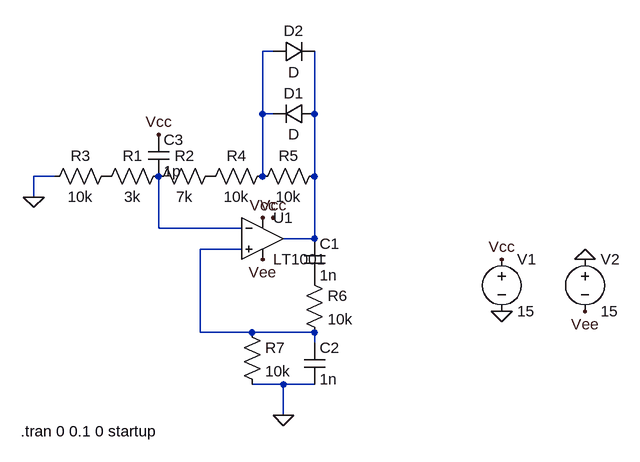
[diagram p0: schematic Draft2.asc]
Draft2.asc, the LTspice schematic file:
Version 4
SHEET 1 880 680
WIRE 192 -112 176 -112
WIRE 176 -16 176 -112
WIRE 192 -16 176 -16
WIRE 256 -16 256 -112
WIRE -144 80 -176 80
WIRE 176 80 176 -16
WIRE 256 80 256 -16
WIRE -176 112 -176 80
WIRE 16 160 16 80
WIRE 144 160 16 160
WIRE 256 176 256 80
WIRE 256 176 208 176
WIRE 144 192 80 192
WIRE 80 320 80 192
WIRE 160 320 80 320
WIRE 256 320 160 320
WIRE 256 336 256 320
WIRE 208 400 160 400
WIRE 256 400 208 400
WIRE 208 448 208 400
FLAG 208 448 0
FLAG -176 112 0
FLAG 544 208 Vcc
FLAG 192 144 Vcc
FLAG 176 144 Vcc
FLAG 176 208 Vee
FLAG 672 288 Vee
FLAG 544 288 0
FLAG 672 208 0
FLAG 16 16 Vcc
SYMBOL Opamps\\LT1001 176 112 R0
SYMATTR InstName U1
SYMBOL res 32 64 R90
WINDOW 0 0 56 VBottom 2
WINDOW 3 32 56 VTop 2
SYMATTR InstName R1
SYMATTR Value 3k
SYMBOL res 112 64 R90
WINDOW 0 0 56 VBottom 2
WINDOW 3 32 56 VTop 2
SYMATTR InstName R2
SYMATTR Value 7k
SYMBOL res -48 64 R90
WINDOW 0 0 56 VBottom 2
WINDOW 3 32 56 VTop 2
SYMATTR InstName R3
SYMATTR Value 10k
SYMBOL res 192 64 R90
WINDOW 0 0 56 VBottom 2
WINDOW 3 32 56 VTop 2
SYMATTR InstName R4
SYMATTR Value 10k
SYMBOL res 272 64 R90
WINDOW 0 0 56 VBottom 2
WINDOW 3 32 56 VTop 2
SYMATTR InstName R5
SYMATTR Value 10k
SYMBOL diode 256 -32 R90
WINDOW 0 0 32 VBottom 2
WINDOW 3 32 32 VTop 2
SYMATTR InstName D1
SYMBOL diode 192 -96 R270
WINDOW 0 32 32 VTop 2
WINDOW 3 0 32 VBottom 2
SYMATTR InstName D2
SYMBOL cap 240 176 R0
SYMATTR InstName C1
SYMATTR Value 1n
SYMBOL cap 240 336 R0
SYMATTR InstName C2
SYMATTR Value 1n
SYMBOL res 240 224 R0
SYMATTR InstName R6
SYMATTR Value 10k
SYMBOL res 144 304 R0
SYMATTR InstName R7
SYMATTR Value 10k
SYMBOL voltage 544 192 R0
WINDOW 123 0 0 Left 2
WINDOW 39 0 0 Left 2
SYMATTR InstName V1
SYMATTR Value 15
SYMBOL voltage 672 192 R0
WINDOW 123 0 0 Left 2
WINDOW 39 0 0 Left 2
SYMATTR InstName V2
SYMATTR Value 15
SYMBOL cap 0 16 R0
SYMATTR InstName C3
SYMATTR Value 1p
TEXT -196 472 Left 2 !.tran 0 0.1 0 startup

The netlist it stands for:
* Draft2.asc
XU1 N004 N003 Vcc Vee N002 LT1001  ; pins In+ In- V+ V- OUT
R1 N003 P001 3k
R2 P002 N003 7k
R3 P001 0 10k
R4 N001 P002 10k
R5 N002 N001 10k
D1 N002 N001 D
D2 N001 N002 D
C1 N002 P003 1n
C2 N004 0 1n
R6 P003 N004 10k
R7 N004 0 10k
V1 Vcc 0 15
V2 0 Vee 15
C3 Vcc N003 1p
.model D D
.lib standard.dio
.tran 0 0.1 0 startup
.lib LTC.lib
.backanno
.end